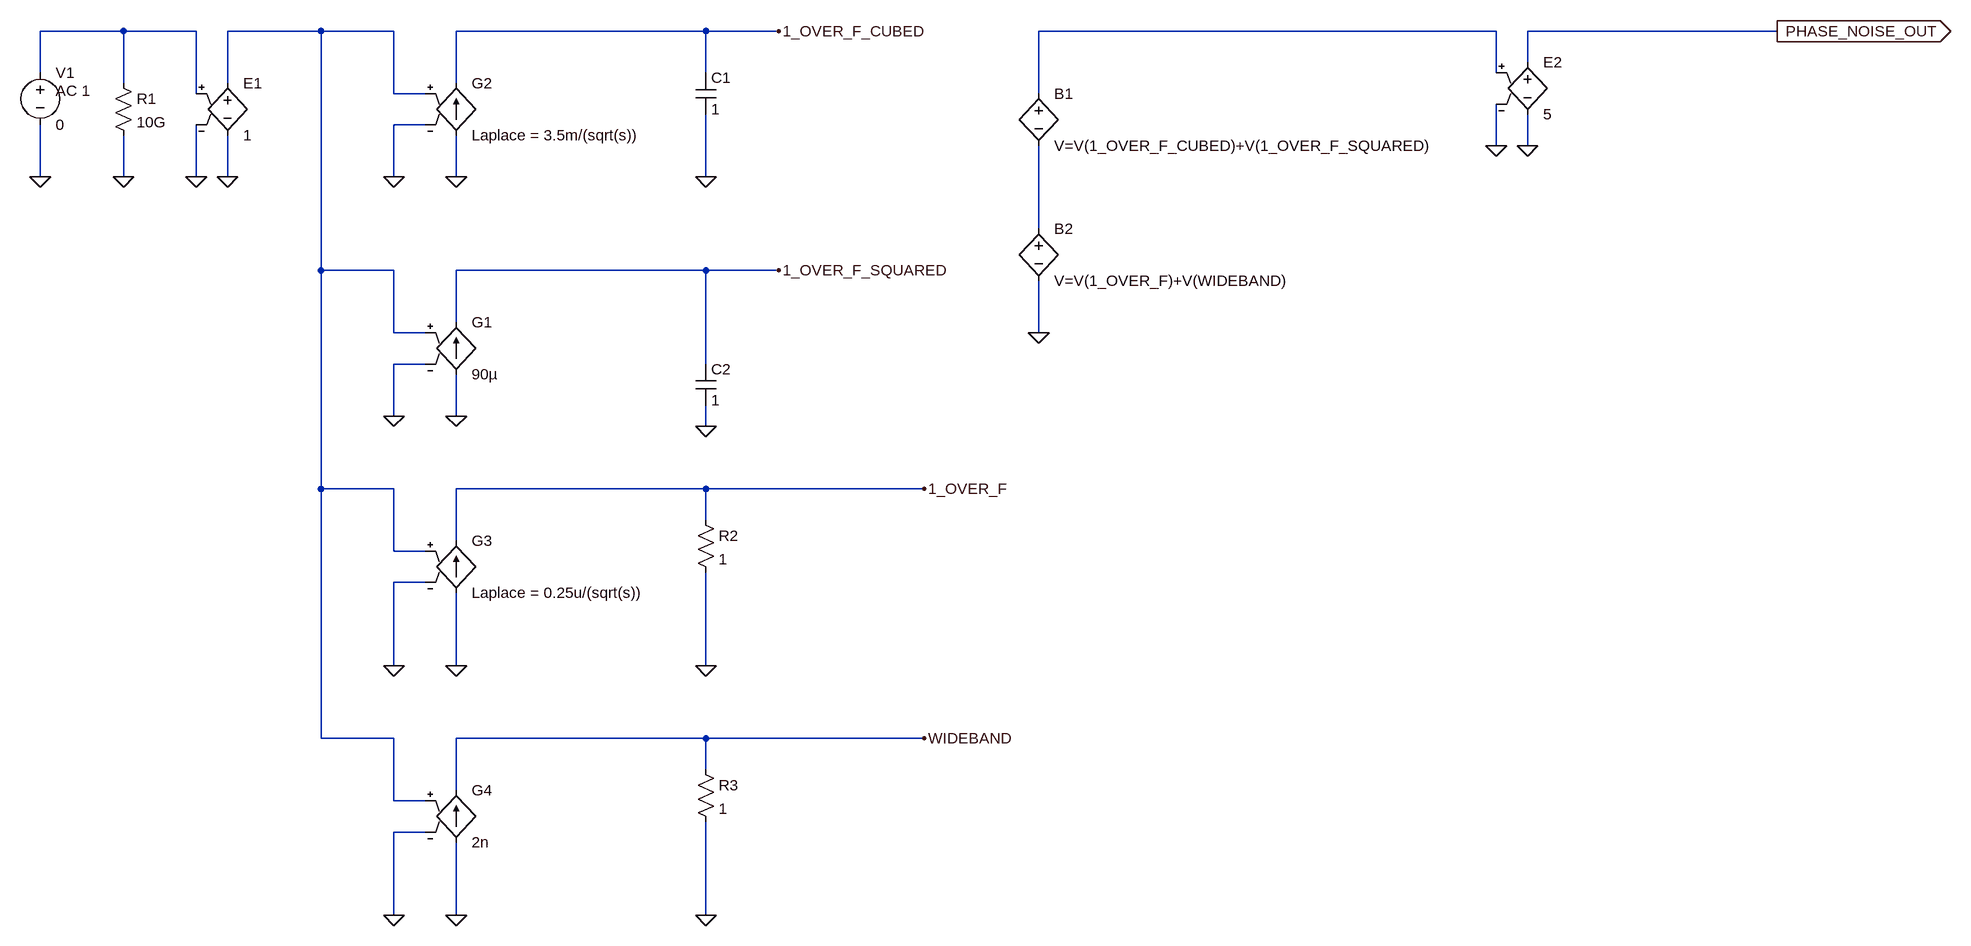
[diagram p0: schematic 536L10001IT5_Phase_Noise_Model.asc]
536L10001IT5_Phase_Noise_Model.asc, the LTspice schematic file:
Version 4
SHEET 1 2116 916
WIRE -720 -464 -848 -464
WIRE -608 -464 -720 -464
WIRE -416 -464 -560 -464
WIRE -304 -464 -416 -464
WIRE 176 -464 -208 -464
WIRE 288 -464 176 -464
WIRE 1392 -464 688 -464
WIRE 1824 -464 1440 -464
WIRE 1440 -416 1440 -464
WIRE -848 -400 -848 -464
WIRE 176 -400 176 -464
WIRE 1392 -400 1392 -464
WIRE -720 -384 -720 -464
WIRE -560 -384 -560 -464
WIRE -208 -384 -208 -464
WIRE -608 -368 -608 -464
WIRE -304 -368 -304 -464
WIRE -256 -368 -304 -368
WIRE 688 -368 688 -464
WIRE -256 -320 -304 -320
WIRE 1392 -288 1392 -352
WIRE 1440 -288 1440 -336
WIRE -848 -240 -848 -320
WIRE -720 -240 -720 -304
WIRE -608 -240 -608 -320
WIRE -560 -240 -560 -304
WIRE -304 -240 -304 -320
WIRE -208 -240 -208 -304
WIRE 176 -240 176 -336
WIRE 688 -160 688 -288
WIRE -416 -96 -416 -464
WIRE -304 -96 -416 -96
WIRE 176 -96 -208 -96
WIRE 288 -96 176 -96
WIRE -208 -16 -208 -96
WIRE -304 0 -304 -96
WIRE -256 0 -304 0
WIRE 688 0 688 -80
WIRE -256 48 -304 48
WIRE 176 48 176 -96
WIRE -304 128 -304 48
WIRE -208 128 -208 64
WIRE 176 144 176 112
WIRE -416 240 -416 -96
WIRE -304 240 -416 240
WIRE 176 240 -208 240
WIRE 512 240 176 240
WIRE 176 288 176 240
WIRE -208 320 -208 240
WIRE -304 336 -304 240
WIRE -256 336 -304 336
WIRE -256 384 -304 384
WIRE -304 512 -304 384
WIRE -208 512 -208 400
WIRE 176 512 176 368
WIRE -416 624 -416 240
WIRE -304 624 -416 624
WIRE 176 624 -208 624
WIRE 512 624 176 624
WIRE 176 672 176 624
WIRE -208 704 -208 624
WIRE -304 720 -304 624
WIRE -256 720 -304 720
WIRE -256 768 -304 768
WIRE -304 896 -304 768
WIRE -208 896 -208 784
WIRE 176 896 176 752
FLAG -208 -240 0
FLAG -304 -240 0
FLAG 176 -240 0
FLAG 288 -464 1_OVER_F_CUBED
FLAG -560 -240 0
FLAG -608 -240 0
FLAG -720 -240 0
FLAG -208 128 0
FLAG -304 128 0
FLAG 176 144 0
FLAG 288 -96 1_OVER_F_SQUARED
FLAG -208 512 0
FLAG -304 512 0
FLAG 176 512 0
FLAG 512 240 1_OVER_F
FLAG -208 896 0
FLAG -304 896 0
FLAG 176 896 0
FLAG 512 624 WIDEBAND
FLAG 688 0 0
FLAG 1824 -464 PHASE_NOISE_OUT
IOPIN 1824 -464 Out
FLAG -848 -240 0
FLAG 1392 -288 0
FLAG 1440 -288 0
SYMBOL g -208 -400 R0
SYMATTR InstName G2
SYMATTR Value Laplace = 3.5m/(sqrt(s))
SYMBOL e -560 -400 R0
SYMATTR InstName E1
SYMATTR Value 1
SYMBOL res -736 -400 R0
SYMATTR InstName R1
SYMATTR Value 10G
SYMBOL cap 160 -400 R0
SYMATTR InstName C1
SYMATTR Value 1
SYMBOL g -208 -32 R0
SYMATTR InstName G1
SYMATTR Value 90µ
SYMBOL cap 160 48 R0
SYMATTR InstName C2
SYMATTR Value 1
SYMBOL g -208 304 R0
SYMATTR InstName G3
SYMATTR Value Laplace = 0.25u/(sqrt(s))
SYMBOL res 160 272 R0
SYMATTR InstName R2
SYMATTR Value 1
SYMBOL g -208 688 R0
SYMATTR InstName G4
SYMATTR Value 2n
SYMBOL res 160 656 R0
SYMATTR InstName R3
SYMATTR Value 1
SYMBOL bv 688 -384 R0
SYMATTR InstName B1
SYMATTR Value V=V(1_OVER_F_CUBED)+V(1_OVER_F_SQUARED)
SYMBOL bv 688 -176 R0
SYMATTR InstName B2
SYMATTR Value V=V(1_OVER_F)+V(WIDEBAND)
SYMBOL voltage -848 -416 R0
WINDOW 123 24 44 Left 2
WINDOW 39 0 0 Left 0
SYMATTR Value2 AC 1
SYMATTR InstName V1
SYMATTR Value 0
SYMBOL e 1440 -432 R0
SYMATTR InstName E2
SYMATTR Value 5

The netlist it stands for:
* 536L10001IT5_Phase_Noise_Model.asc
G2 0 1_OVER_F_CUBED N002 0 Laplace = 3.5m/(sqrt(s))
E1 N002 0 N001 0 1
R1 N001 0 10G
C1 1_OVER_F_CUBED 0 1
G1 0 1_OVER_F_SQUARED N002 0 90µ
C2 1_OVER_F_SQUARED 0 1
G3 0 1_OVER_F N002 0 Laplace = 0.25u/(sqrt(s))
R2 1_OVER_F 0 1
G4 0 WIDEBAND N002 0 2n
R3 WIDEBAND 0 1
B1 N003 N004 V=V(1_OVER_F_CUBED)+V(1_OVER_F_SQUARED)
B2 N004 0 V=V(1_OVER_F)+V(WIDEBAND)
V1 N001 0 0 AC 1
E2 PHASE_NOISE_OUT 0 N003 0 5
.backanno
.end